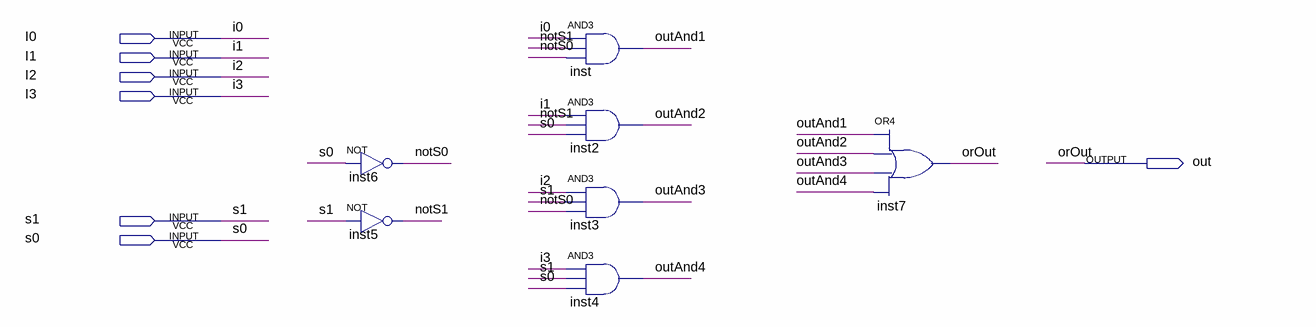
[diagram p0: schematic sheet]
// Quartus schematic multiplexer.bdf as structural Verilog: 7 symbols, 7 pins
module multiplexer (
  input  I0,
  input  I1,
  input  I2,
  input  I3,
  input  s1,
  input  s0,
  output out
);

  wire notS0, notS1, outAnd1, outAnd2, outAnd3, outAnd4;

  not inst6 (notS0, s0);
  not inst5 (notS1, s1);
  and inst (outAnd1, I0, notS1, notS0);
  and inst2 (outAnd2, I1, notS1, s0);
  and inst3 (outAnd3, I2, s1, notS0);
  and inst4 (outAnd4, I3, s1, s0);
  or inst7 (out, outAnd1, outAnd2, outAnd3, outAnd4);

  // Other names for the same wires on the sheet: orOut = out
endmodule
